# EAGLE schematic HHModules (EAGLE 7.7.0)
HHPrototype

## Sheet 1 of 2: HH Prototype Connectors
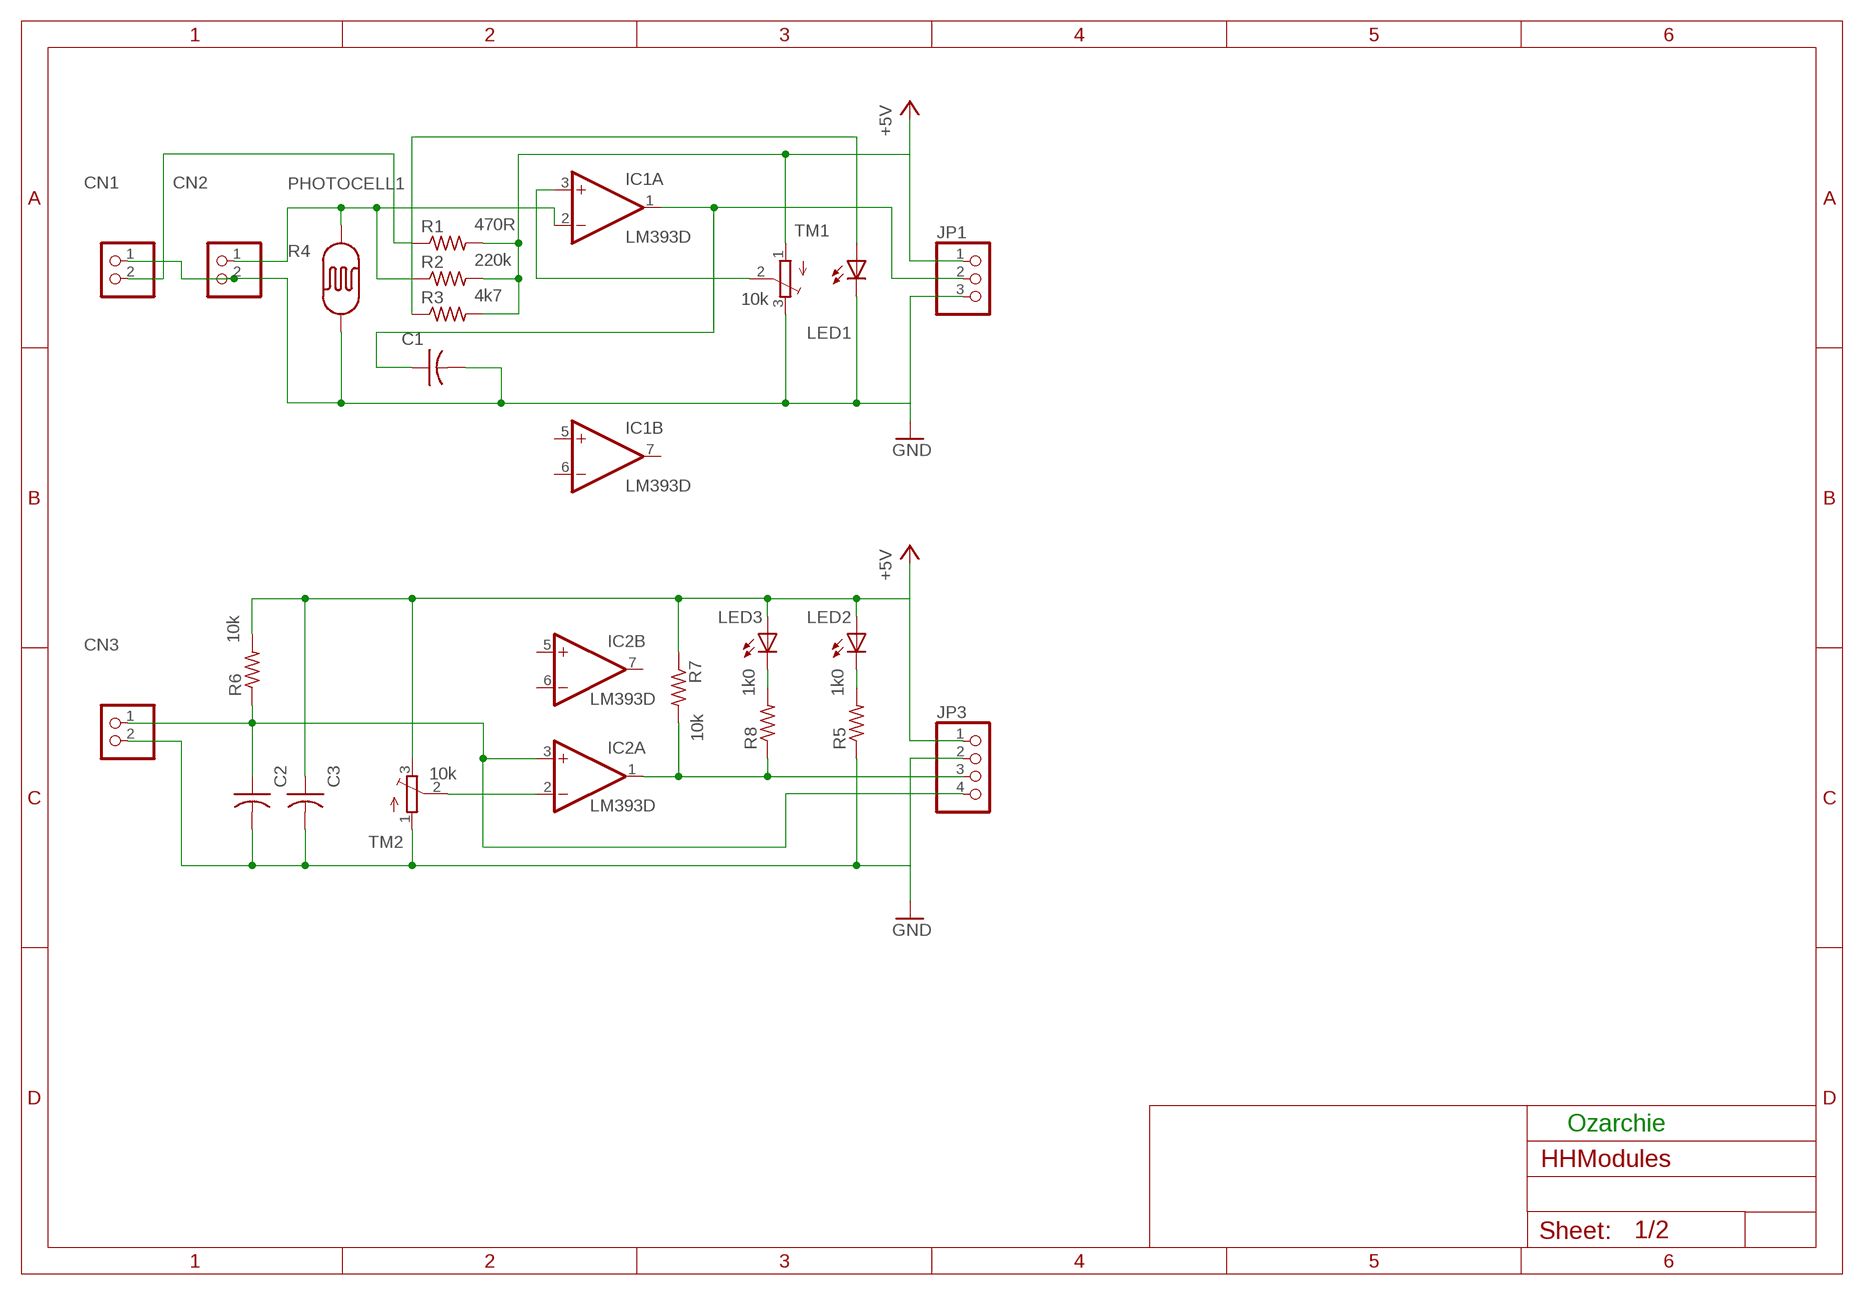
[diagram p0: schematic, sheet 1]

### Parts
C1  C-USC0805K  [C0805K]
C2  C-USC0805K  [C0805K]
C3  C-USC0805K  [C0805K]
CN1  JST_2PIN-THM  [JST-PH-2-THM]
CN2  JST_2PIN-THM  [JST-PH-2-THM]
CN3  JST_2PIN-THM  [JST-PH-2-THM]
IC1  LM393D  [SO08]
IC2  LM393D  [SO08]
JP1  PINHD-1X3  [1X03]
JP3  PINHD-1X4  [1X04]
LED1  LEDCHIPLED_1206  [CHIPLED_1206]
LED2  LEDCHIPLED_1206  [CHIPLED_1206]
LED3  LEDCHIPLED_1206  [CHIPLED_1206]
R1  470R  R-US_M1206  [M1206]
R2  220k  R-US_M1206  [M1206]
R3  4k7  R-US_M1206  [M1206]
R4  PHOTOCELL1  [LDR_OFFBOARD]
R5  1k0  R-US_M1206  [M1206]
R6  10k  R-US_M1206  [M1206]
R7  10k  R-US_M1206  [M1206]
R8  1k0  R-US_M1206  [M1206]
TM1  10k  TRIMPOT3386  [TRIM-3386]
TM2  10k  TRIMPOT3386  [TRIM-3386]

### Nets
+5V: C3.1 JP1.1 JP3.1 LED2.A LED3.A R1.2 R2.2 R3.2 R6.2 R7.1 TM1.1(A) TM2.3(E) ; also sheet 2
GND: C1.2 C2.2 C3.2 CN1.1 CN2.2 CN3.2 JP1.3 JP3.2 LED1.C R4.1 R5.1 TM1.3(E) TM2.1(A) ; also sheet 2
N$1: LED1.A R3.1
N$2: C2.1 CN3.1 IC2.3(A:+IN) JP3.4 R6.1
N$4: IC2.2(A:-IN) TM2.2(S)
N$6: C1.1 IC1.1(A:OUT) JP1.2
N$7: LED2.C R5.2
N$8: IC1.3(A:+IN) TM1.2(S)
N$9: CN2.1 IC1.2(A:-IN) R2.1 R4.2
N$11: CN1.2 R1.1
N$12: LED3.C R8.2
N$18: IC2.1(A:OUT) JP3.3 R7.2 R8.1
Unconnected: IC1.5(B:+IN) IC1.6(B:-IN) IC1.7(B:OUT) IC2.5(B:+IN) IC2.6(B:-IN) IC2.7(B:OUT)

### Notes on the sheet
- Ozarchie

## Sheet 2 of 2: HH Prototype Modules
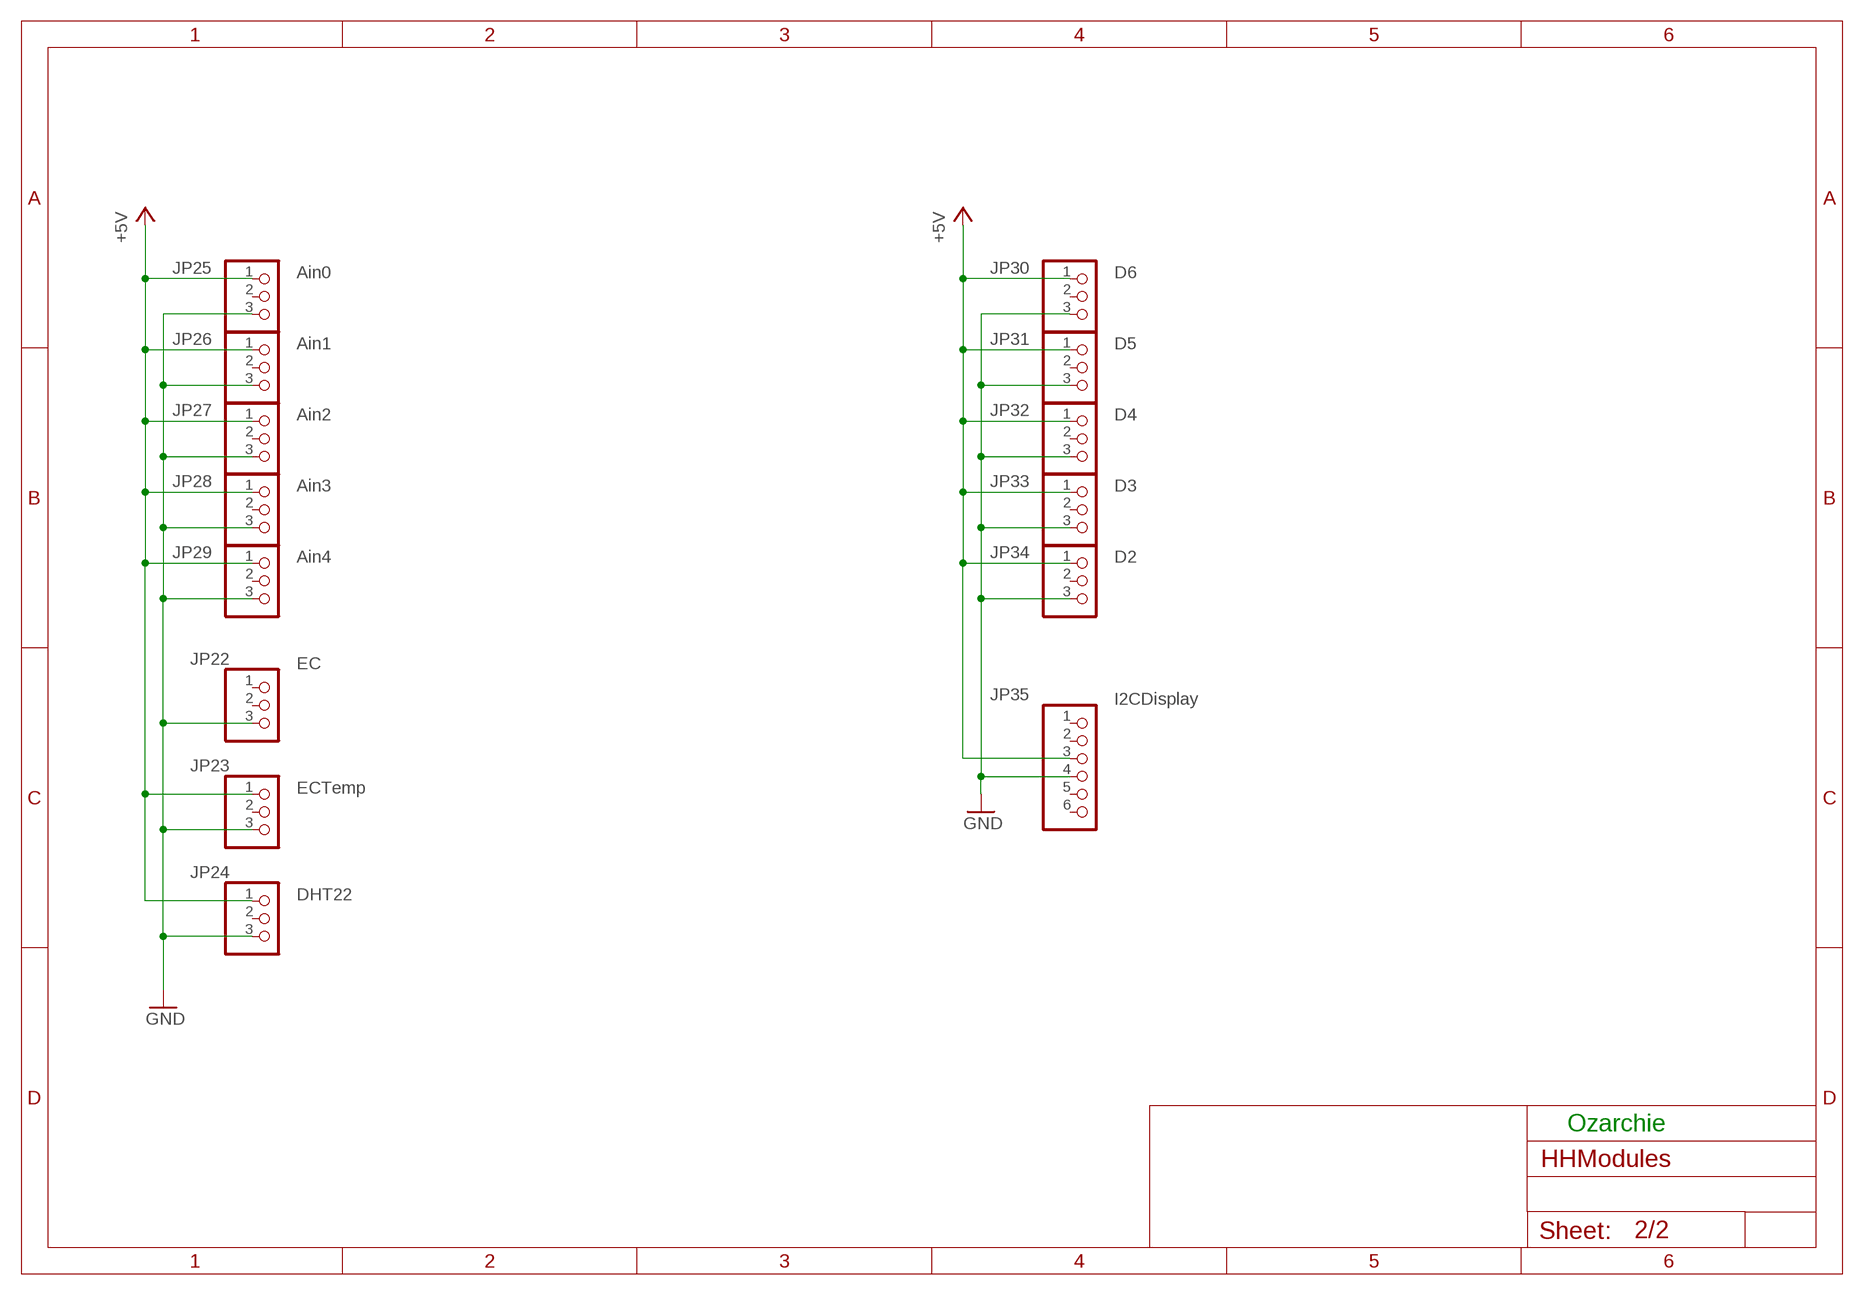
[diagram p1: schematic, sheet 2]

### Parts
JP22  EC  PINHD-1X3  [1X03]
JP23  ECTemp  PINHD-1X3  [1X03]
JP24  DHT22  PINHD-1X3  [1X03]
JP25  Ain0  PINHD-1X3  [1X03]
JP26  Ain1  PINHD-1X3  [1X03]
JP27  Ain2  PINHD-1X3  [1X03]
JP28  Ain3  PINHD-1X3  [1X03]
JP29  Ain4  PINHD-1X3  [1X03]
JP30  D6  PINHD-1X3  [1X03]
JP31  D5  PINHD-1X3  [1X03]
JP32  D4  PINHD-1X3  [1X03]
JP33  D3  PINHD-1X3  [1X03]
JP34  D2  PINHD-1X3  [1X03]
JP35  I2CDisplay  PINHD-1X6  [1X06]

### Nets
+5V: JP23.1 JP24.1 JP25.1 JP26.1 JP27.1 JP28.1 JP29.1 JP30.1 JP31.1 JP32.1 JP33.1 JP34.1 JP35.3 ; also sheet 1
GND: JP22.3 JP23.3 JP24.3 JP25.3 JP26.3 JP27.3 JP28.3 JP29.3 JP30.3 JP31.3 JP32.3 JP33.3 JP34.3 JP35.4 ; also sheet 1
Unconnected: JP22.1 JP22.2 JP23.2 JP24.2 JP25.2 JP26.2 JP27.2 JP28.2 JP29.2 JP30.2 JP31.2 JP32.2 JP33.2 JP34.2 JP35.1 JP35.2 JP35.5 JP35.6

### Notes on the sheet
- Ozarchie

## Power pins joined to a net without a drawn wire
V+: IC1.8(P:V+) IC2.8(P:V+)
V-: IC1.4(P:V-) IC2.4(P:V-)

## Library data of the parts
C1-C3 = adafruit:C-US: CAPACITOR, American symbol
CN1-CN3 = adafruit:JST_2PIN: JST 2-Pin Connectors of various flavors SMT-RA (S2B-PH-SM4) 4UConnector #17311 SMT (B2B-PH-SM4) THM-RA (S2B-PH) THM (B2B-PH)
IC1 IC2 = linear:LM393: COMPARATOR
JP1 JP22-JP34 = adafruit:PINHD-1X3: PIN HEADER
JP3 = pinhead:PINHD-1X4: PIN HEADER
JP35 = adafruit:PINHD-1X6: PIN HEADER
LED1-LED3 = led:LED: LED OSRAM: - CHIPLED LG R971, LG N971, LY N971, LG Q971, LY Q971, LO R971, LY R971 LH N974, LH R974 LS Q976, LO Q976, LY Q976 LO Q996 - Hyper CHIPLED LW Q18S LB Q993, LB Q99A, LB R99A - SideLED LS A670, LO A670, LY A670, LG A670, LP A670 LB A673, LV A673, LT A673, LW A673 LH A674 LY A675 LS A676, LA A676, LO A676, LY A676, LW A676 LS A679, LY A679, LG A679 - Hyper Micro SIDELED® LS Y876, LA Y876, LO Y876, LY Y876 LT Y87S - SmartLED LW L88C, LW L88S LB L89C, LB L89S, LG L890 LS L89K, LO L89K, LY L89K LS L896, LA L896, LO L896, LY L896 - TOPLED LS T670, LO T670, LY T670, LG T670, LP T670 LSG T670, LSP T670, LSY T670, LOP T670, LYG T670 LG T671, LOG T671, LSG T671 LB T673, LV T673, LT T673, LW T673 LH T674 LS T676, LA T676, LO T676, LY T676, LB T676, LH T676, LSB T676, LW T676 LB T67C, LV T67C, LT T67C, LS T67K, LO T67K, LY T67K, LW E67C LS E67B, LA E67B, LO E67B, LY E67B, LB E67C, LV E67C, LT E67C LW T67C LS T679, LY T679, LG T679 LS T770, LO T770, LY T770, LG T770, LP T770 LB T773, LV T773, LT T773, LW T773 LH T774 LS E675, LA E675, LY E675, LS T675 LS T776, LA T776, LO T776, LY T776, LB T776 LHGB T686 LT T68C, LB T68C - Hyper Mini TOPLED® LB M676 - Mini TOPLED Santana® LG M470 LS M47K, LO M47K, LY M47K Source: http://www.osram.convergy.de LUXEON: - LUMILED® LXK2-PW12-R00, LXK2-PW12-S00, LXK2-PW14-U00, LXK2-PW14-V00 LXK2-PM12-R00, LXK2-PM12-S00, LXK2-PM14-U00 LXK2-PE12-Q00, LXK2-PE12-R00, LXK2-PE12-S00, LXK2-PE14-T00, LXK2-PE14-U00 LXK2-PB12-K00, LXK2-PB12-L00, LXK2-PB12-M00, LXK2-PB14-N00, LXK2-PB14-P00, LXK2-PB14-Q00 LXK2-PR12-L00, LXK2-PR12-M00, LXK2-PR14-Q00, LXK2-PR14-R00 LXK2-PD12-Q00, LXK2-PD12-R00, LXK2-PD12-S00 LXK2-PH12-R00, LXK2-PH12-S00 LXK2-PL12-P00, LXK2-PL12-Q00, LXK2-PL12-R00 Source: www.luxeon.com KINGBRIGHT: KA-3528ASYC Source: www.kingbright.com
R1-R3 R5-R8 = adafruit:R-US_: RESISTOR, American symbol
R4 = ldr:PHOTOCELL: Photo Resitor
TM1 TM2 = adafruit:TRIMPOT: SMT trimmer potentiometer part number TC33X http://www.ladyada.net/library/eagle